# Altium schematic sheet Power Bank Circuit.schdoc
size 303 x 182 mm
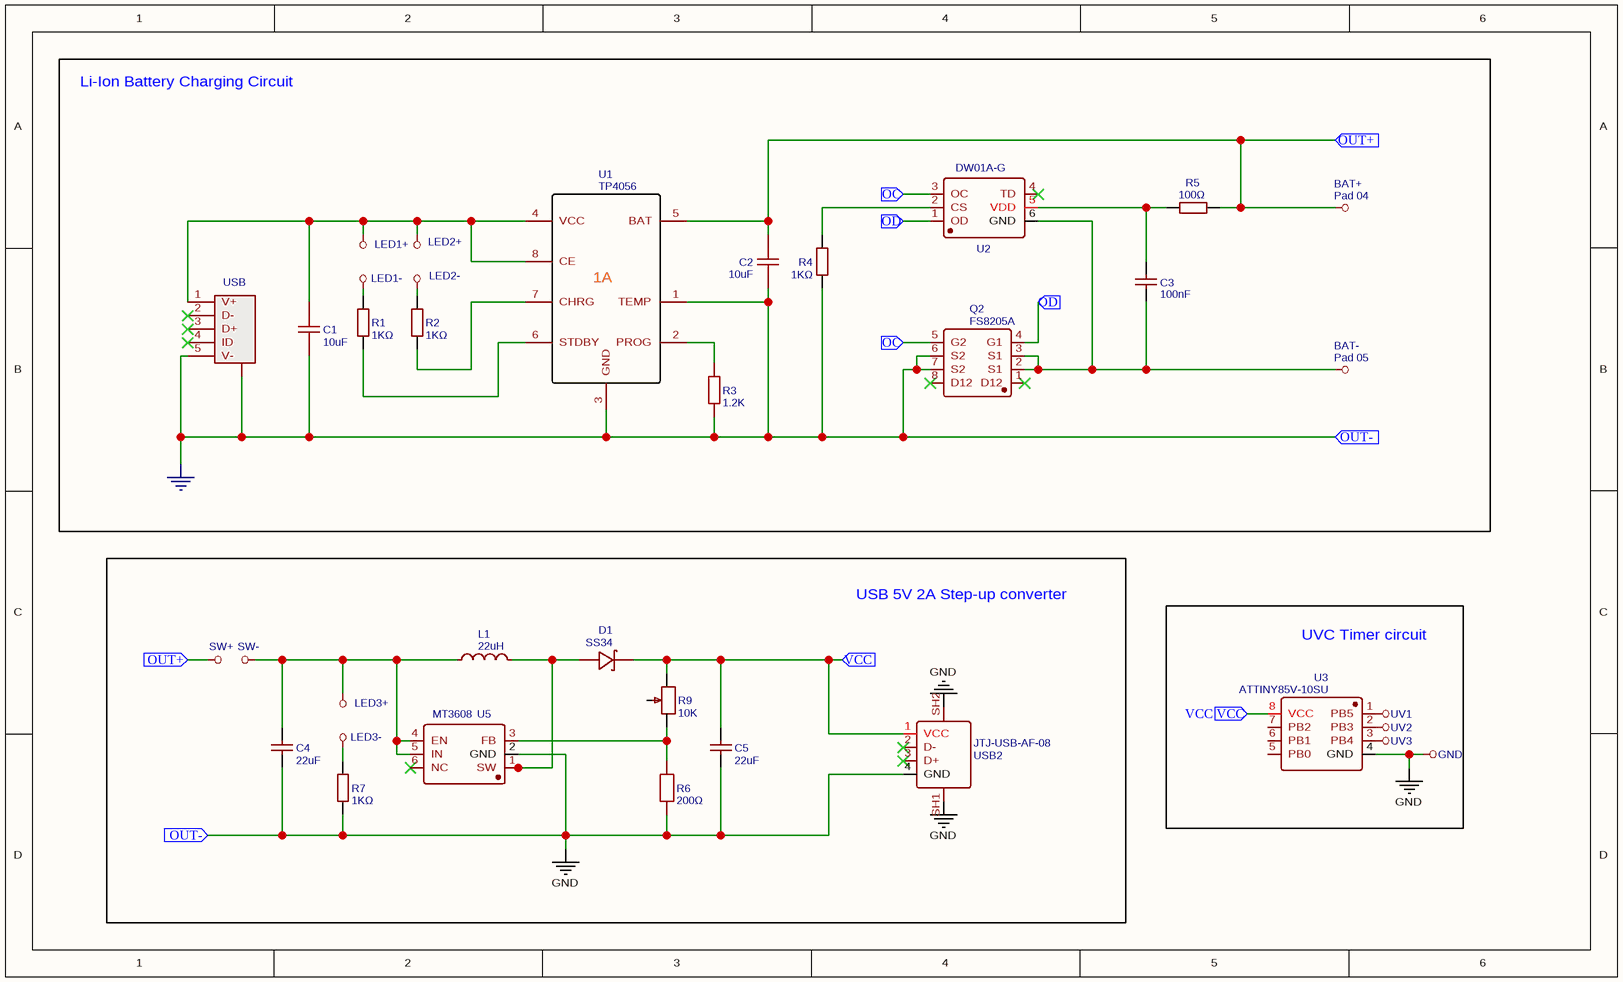
[diagram p0: Power Bank Circuit.schdoc]

## Parts
BAT+  Pad 04  [CON_PAD_SQUARE_32MIL]
BAT-  Pad 05  [CON_PAD_SQUARE_32MIL]
C1  10uF  [C0603]
C2  10uF  [C0603]
C3  100nF  [C0402]
C4  22uF  [C0805]
C5  22uF  [C0805]
D1  SS34  [SMB_L4.6-W3.6-LS5.3-RD]
GND  Pad 05  [CON_PAD_SQUARE_32MIL]  (value not drawn)
L1  22uH  [IND-SMD_L7.8-W7.0_MAPM0630F]
LED1+  Pad 05  [CON_PAD_SQUARE_32MIL]  (value not drawn)
LED1-  Pad 05  [CON_PAD_SQUARE_32MIL]  (value not drawn)
LED2+  Pad 05  [CON_PAD_SQUARE_32MIL]  (value not drawn)
LED2-  Pad 05  [CON_PAD_SQUARE_32MIL]  (value not drawn)
LED3+  Pad 05  [CON_PAD_SQUARE_32MIL]  (value not drawn)
LED3-  Pad 05  [CON_PAD_SQUARE_32MIL]  (value not drawn)
Q2  FS8205A  [TSSOP-8_L4.4-W3.0-P0.65-LS6.4-BL-2]
R1  1KΩ  [R0402]
R2  1KΩ  [R0402]
R3  1.2K  [R0402]
R4  1KΩ  [R0402]
R5  100Ω  [R0603]
R6  200Ω  [R1206]
R7  1KΩ  [R0402]
R9  10K  [RES-ADJ-TH_3296W]
SW+  Pad 05  [CON_PAD_SQUARE_32MIL]  (value not drawn)
SW-  Pad 05  [CON_PAD_SQUARE_32MIL]  (value not drawn)
U1  TP4056  [SOP-8_EP_150MIL]
U2  DW01A-G  [SOT-23-6]
U3  ATTINY85V-10SU  [SOIC-8_L5.3-W5.3-P1.27-LS8.0-BL]
U5  MT3608  [SOT-23-6_L2.9-W1.6-P0.95-LS2.8-BR]
USB  micro 5PBoard5.9No column plus welding feet  [MICRO-USB-SMD_5P-P0.65-H-F-C40955]  (value not drawn)
USB2  JTJ-USB-AF-08  [USB-A-TH__USB-AF-90]
UV1  Pad 05  [CON_PAD_SQUARE_32MIL]  (value not drawn)
UV2  Pad 05  [CON_PAD_SQUARE_32MIL]  (value not drawn)
UV3  Pad 05  [CON_PAD_SQUARE_32MIL]  (value not drawn)

## Blocks framed on the sheet
USB 5V 2A Step-up converter: C4 C5 D1 L1 LED3+ LED3- R6 R7 R9 SW+ SW- U5 USB2
UVC Timer circuit: GND U3 UV1-UV3

## Ports
OC (in), OD (in), OUT+ (in), OUT- (in), VCC (in)

## Nets
GND: C1.1 C2.1 C4.1 C5.2 GND.P Q2.6(S2) Q2.7(S2) R3.1 R4.1 R6.1 R7.1 U1.1(TEMP) U1.3(GND) U3.4(GND) U5.2(GND) USB.0(MTN6) USB.5(V-) USB2.4(GND) USB2.SH1 USB2.SH2 ; port OUT-
OC: Q2.5(G2) U2.3(OC) ; port OC
OD: Q2.4(G1) U2.1(OD) ; port OD
OUT+: BAT+.P C2.2 R5.2 SW+.P U1.5(BAT) ; port OUT+
VCC: C5.1 D1.1(C) R9.1 U3.8(VCC) USB2.1(VCC) ; port VCC
NetBAT-_P: BAT-.P C3.1 Q2.2(S1) Q2.3(S1) U2.6(GND)
NetC1_2: C1.2 LED1+.P LED2+.P U1.4(VCC) U1.8(CE) USB.1(V+)
NetC3_2: C3.2 R5.1 U2.5(VDD)
NetC4_2: C4.2 L1.1 LED3+.P SW-.P U5.4(EN) U5.5(IN)
NetD1_2: D1.2(A) L1.2 U5.1(SW)
NetLED1-_P: LED1-.P R1.2
NetLED2-_P: LED2-.P R2.2
NetLED3-_P: LED3-.P R7.2
NetR1_1: R1.1 U1.6(STDBY)
NetR2_1: R2.1 U1.7(CHRG)
NetR3_2: R3.2 U1.2(PROG)
NetR4_2: R4.2 U2.2(CS)
NetR6_2: R6.2 R9.3 U5.3(FB)
NetU3_1: U3.1(PB5) UV1.P
NetU3_2: U3.2(PB3) UV2.P
NetU3_3: U3.3(PB4) UV3.P

Not connected (* = marked no-connect by the designer): Q2 1(D12)* 8(D12)*; R9 2; U2 4(TD)*; U3 5(PB0) 6(PB1) 7(PB2); U5 6(NC)*; USB 2(D-)* 3(D+)* 4(ID)*; USB2 2(D-)* 3(D+)*

## Notes on the sheet
- Li-Ion Battery Charging Circuit
- (near U1) 1A
- VCC

## Library data of the parts
BAT+ = Pad 04: Contributor: DangerousPrototype; BOM_Manufacturer Part: ?; spicePre: T
BAT- GND LED1+ LED1- LED2+ LED2- LED3+ LED3- SW+ SW- UV1-UV3 = Pad 05: Contributor: DangerousPrototype; BOM_Manufacturer Part: ?; spicePre: T
C1 C2 = 10uF: BOM_Manufacturer: SAMSUNG; BOM_Manufacturer Part: CL10A106MA8NRNC; nameAlias: Capacitance; SMT Type: Extend; BOM_Supplier: LCSC; BOM_Supplier Part: C96446; BOM_LCSC Assembly: Yes; spicePre: C; spiceSymbolName: CL10A106MA8NRNC
C3 = 100nF: BOM_Manufacturer Part: CL05B104KO5NNNC; BOM_Manufacturer: SAMSUNG; nameAlias: Capacitance; SMT Type: Basic; BOM_Supplier: LCSC; BOM_LCSC Assembly: Yes; BOM_Supplier Part: C1525; spicePre: C; spiceSymbolName: CL05B104KO5NNNC
C4 C5 = 22uF: BOM_Manufacturer: MuRata; BOM_Manufacturer Part: GRM21BR60J226ME39L; nameAlias: Capacitance; BOM_Supplier: LCSC; BOM_Supplier Part: C77071; spicePre: C; spiceSymbolName: GRM21BR60J226ME39L
D1 = SS34: BOM_Manufacturer: Bourne Semicon (Shenzhen); Contributor: LCSC; BOM_Supplier: LCSC; BOM_Supplier Part: C266556; BOM_Manufacturer Part: SS34; BOM_JLCPCB Part Class: Extended Part; spicePre: D; spiceSymbolName: SS34_C266556
L1 = 22uH: BOM_Manufacturer: Jinlai; BOM_Manufacturer Part: JSHC0650H-220M-G; nameAlias: Inductance; Contributor: LCSC; BOM_Supplier: LCSC; BOM_Supplier Part: C334097; spicePre: L; spiceSymbolName: JSHC0650H-220M-G
Q2 = FS8205A: BOM_Manufacturer: FORTUNE; BOM_Supplier: LCSC; BOM_Manufacturer Part: FS8205A; BOM_Supplier Part: C16052; BOM_JLCPCB Part Class: Basic Part; spicePre: Q; spiceSymbolName: FS8205A
R1 R2 R4 R7 = 1KΩ: BOM_Manufacturer: UniOhm; BOM_Manufacturer Part: 0402WGF1001TCE; nameAlias: Resistance (Ohms); SMT Type: Basic; BOM_Supplier: LCSC; BOM_LCSC Assembly: Yes; BOM_Supplier Part: C11702; spicePre: R; spiceSymbolName: 0402WGF1001TCE
R3 = 1.2K: BOM_Manufacturer: BOURNS; BOM_Manufacturer Part: CR0402-JW-122GLF; nameAlias: Resistance (Ohms); Contributor: LCSC; BOM_Supplier: LCSC; BOM_Supplier Part: C203113; BOM_JLCPCB Part Class: Extended Part; spicePre: R; spiceSymbolName: CR0402-JW-122GLF
R5 = 100Ω: BOM_Manufacturer: UniOhm; BOM_Manufacturer Part: 0603WAF1000T5E; nameAlias: Resistance (Ohms); SMT Type: Basic; BOM_Supplier: LCSC; BOM_LCSC Assembly: Yes; BOM_Supplier Part: C22775; spicePre: R; spiceSymbolName: 0603WAF1000T5E
R6 = 200Ω: BOM_Manufacturer: UNI-ROYAL(Uniroyal Elec); BOM_Manufacturer Part: TC0625B2000T5K; nameAlias: Resistance (Ohms); Contributor: LCSC; BOM_Supplier: LCSC; BOM_Supplier Part: C517534; spicePre: R; spiceSymbolName: TC0625B2000T5K
R9 = 10K: BOM_Manufacturer: BOURNS; BOM_Manufacturer Part: 3296W-1-103LF; nameAlias: Resistance (Ohms); BOM_Supplier: LCSC; BOM_Supplier Part: C34846; Resistance(Ohms): 10K; spicePre: R; spiceSymbolName: 3296W-1-103LF
U1 = TP4056: BOM_Manufacturer: TOPPOWER; Contributor: Guest; BOM_Supplier: LCSC; BOM_Manufacturer Part: TP4056; BOM_LCSC Assembly: Yes; image: //image.lceda.cn/szlcsc/C16581.jpg; spicePre: U; BOM_Supplier Part: C16581
U2 = DW01A-G: BOM_Manufacturer: FORTUNE; Contributor: LCSC; Package Display: No; BOM_Supplier: LCSC; BOM_Manufacturer Part: DW01A-G; spicePre: U; BOM_Supplier Part: C61503
U3 = ATTINY85V-10SU: BOM_Manufacturer: Microchip Tech; Contributor: LCSC; BOM_Supplier: LCSC; BOM_Supplier Part: C152192; BOM_Manufacturer Part: ATTINY85V-10SU; BOM_JLCPCB Part Class: Extended Part; spicePre: U; spiceSymbolName: ATTINY85V-10SU
U5 = MT3608: BOM_Manufacturer: AEROSEMI; BOM_Supplier: LCSC; BOM_Manufacturer Part: MT3608; BOM_Supplier Part: C84817; BOM_JLCPCB Part Class: Extended Part; spicePre: U; spiceSymbolName: MT3608
USB = micro 5PBoard5.9No column plus welding feet: BOM_Manufacturer: ValuePro; Package Display: No; BOM_Supplier: LCSC; BOM_Manufacturer Part: micro 5PBoard5.9No column plus welding feet; image: //image.lceda.cn/szlcsc/C40955.jpg; BOM_Supplier Part: C40955; spicePre: U; spiceSymbolName: micro 5PBoard5.9No column plus welding feet
USB2 = JTJ-USB-AF-08: Contributor: LCSC; BOM_Supplier: LCSC; BOM_Manufacturer Part: JTJ-USB-AF-08; BOM_Supplier Part: C2345; BOM_JLCPCB Part Class: Extended Part; spicePre: U; spiceSymbolName: JTJ-USB-AF-08